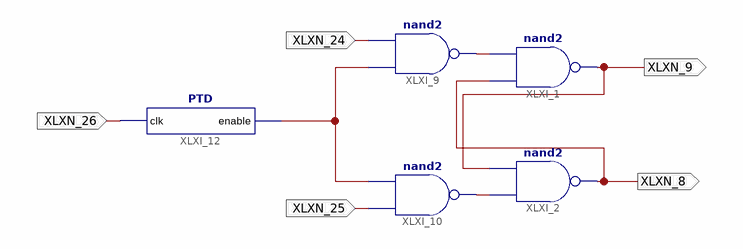
[diagram p0: schematic sheet 1]
// Xilinx ISE schematic Flip_Flop.sch (virtex5) as structural Verilog: 5 symbols, 5 ports
module Flip_Flop (
  input  XLXN_24,
  input  XLXN_25,
  input  XLXN_26,
  output XLXN_8,
  output XLXN_9
);

  wire XLXN_20, XLXN_21, XLXN_22;

  nand XLXI_1 (XLXN_9, XLXN_8, XLXN_20);
  nand XLXI_2 (XLXN_8, XLXN_21, XLXN_9);
  nand XLXI_9 (XLXN_20, XLXN_22, XLXN_24);
  nand XLXI_10 (XLXN_21, XLXN_25, XLXN_22);
  PTD XLXI_12 (.clk(XLXN_26), .enable(XLXN_22));
endmodule
